# EAGLE design spi mit sram v1 (EAGLE 9.5.2)
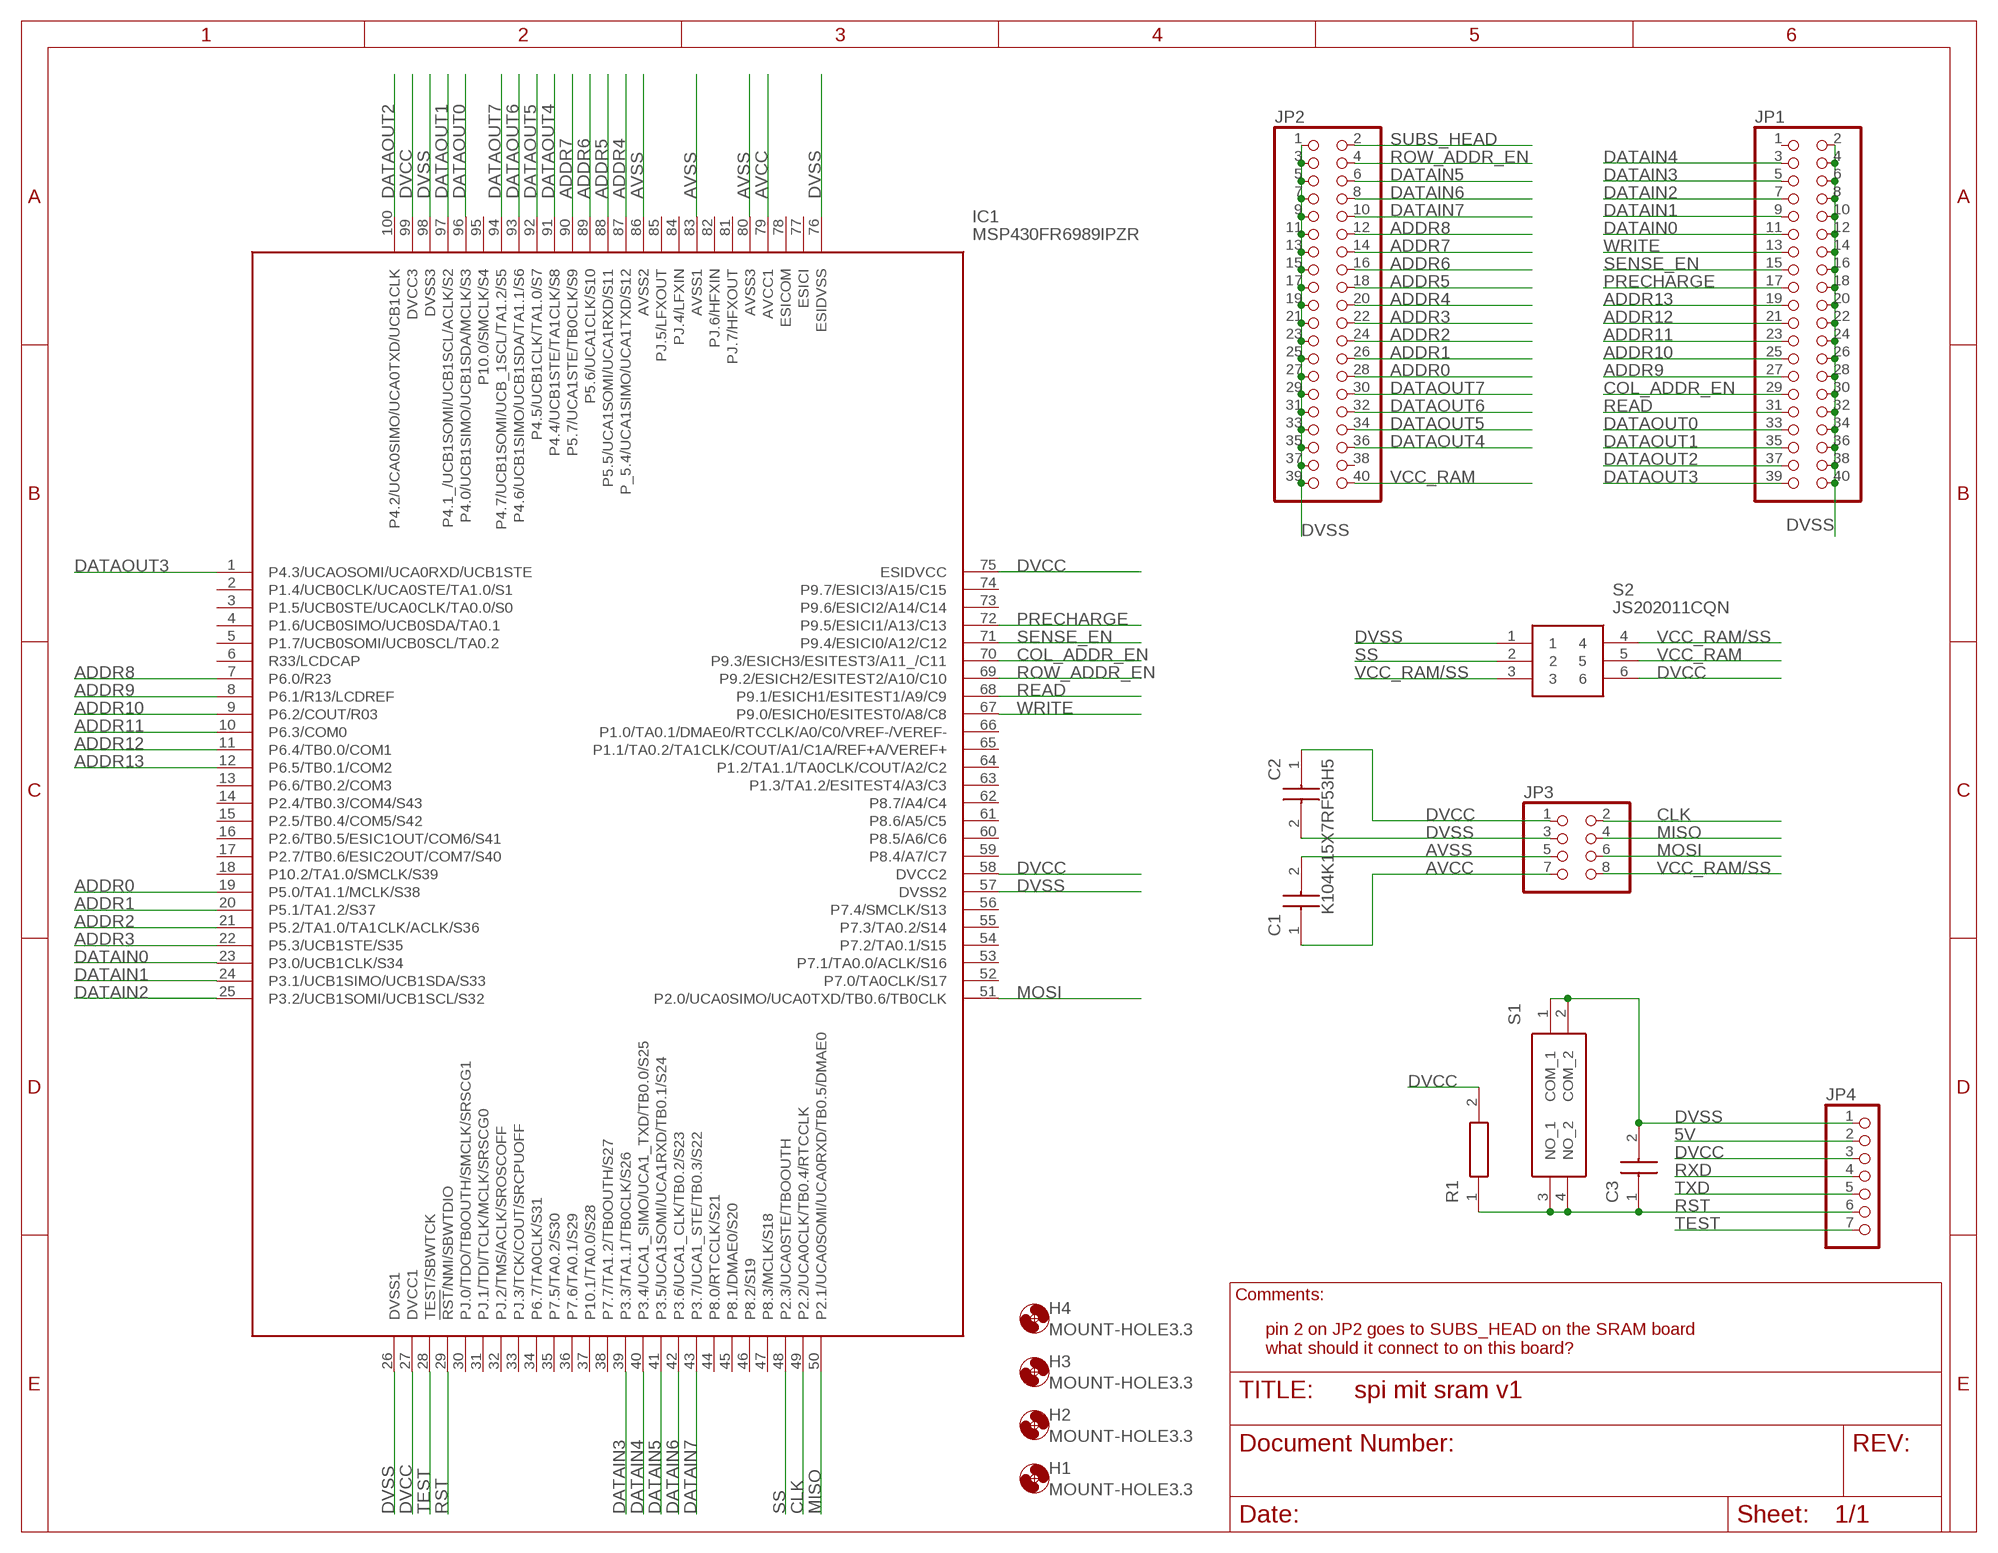
[diagram p0: schematic, sheet 1]

## Parts
C1  K104K15X7RF53H5  [K104K15X7RF53H5]
C2  K104K15X7RF53H5  [K104K15X7RF53H5]
C3  K104K15X7RF53H5  [K104K15X7RF53H5]
H1  MOUNT-HOLE3.3  [3,3]
H2  MOUNT-HOLE3.3  [3,3]
H3  MOUNT-HOLE3.3  [3,3]
H4  MOUNT-HOLE3.3  [3,3]
IC1  MSP430FR6989IPZR  [QFP50P1600X1600X160-100N]
JP1  PINHD-2X20  [2X20]
JP2  PINHD-2X20  [2X20]
JP3  PINHD-2X4  [2X04]
JP4  PINHD-1X7  [1X07]
R1  MF0207FTE52-10K  [RESAD1590W60L630D240]
S1  1825910-3  [18259103]
S2  JS202011CQN  [JS202011CQN]

## Nets
5V: JP4.2
ADDR0: IC1.19(P5.0/TA1.1/MCLK/S38) JP2.28
ADDR1: IC1.20(P5.1/TA1.2/S37) JP2.26
ADDR2: IC1.21(P5.2/TA1.0/TA1CLK/ACLK/S36) JP2.24
ADDR3: IC1.22(P5.3/UCB1STE/S35) JP2.22
ADDR4: IC1.87(P_5.4/UCA1SIMO/UCA1TXD/S12) JP2.20
ADDR5: IC1.88(P5.5/UCA1SOMI/UCA1RXD/S11) JP2.18
ADDR6: IC1.89(P5.6/UCA1CLK/S10) JP2.16
ADDR7: IC1.90(P5.7/UCA1STE/TB0CLK/S9) JP2.14
ADDR8: IC1.7(P6.0/R23) JP2.12
ADDR9: IC1.8(P6.1/R13/LCDREF) JP1.27
ADDR10: IC1.9(P6.2/COUT/R03) JP1.25
ADDR11: IC1.10(P6.3/COM0) JP1.23
ADDR12: IC1.11(P6.4/TB0.0/COM1) JP1.21
ADDR13: IC1.12(P6.5/TB0.1/COM2) JP1.19
AVCC: C1.1 IC1.79(AVCC1) JP3.7
AVSS: C1.2 IC1.80(AVSS3) IC1.83(AVSS1) IC1.86(AVSS2) JP3.5
CLK: IC1.49(P2.2/UCA0CLK/TB0.4/RTCCLK) JP3.2
COL_ADDR_EN: IC1.70(P9.3/ESICH3/ESITEST3/A11_/C11) JP1.29
DATAIN0: IC1.23(P3.0/UCB1CLK/S34) JP1.11
DATAIN1: IC1.24(P3.1/UCB1SIMO/UCB1SDA/S33) JP1.9
DATAIN2: IC1.25(P3.2/UCB1SOMI/UCB1SCL/S32) JP1.7
DATAIN3: IC1.39(P3.3/TA1.1/TB0CLK/S26) JP1.5
DATAIN4: IC1.40(P3.4/UCA1_SIMO/UCA1_TXD/TB0.0/S25) JP1.3
DATAIN5: IC1.41(P3.5/UCA1SOMI/UCA1RXD/TB0.1/S24) JP2.6
DATAIN6: IC1.42(P3.6/UCA1_CLK/TB0.2/S23) JP2.8
DATAIN7: IC1.43(P3.7/UCA1_STE/TB0.3/S22) JP2.10
DATAOUT0: IC1.96(P4.0/UCB1SIMO/UCB1SDA/MCLK/S3) JP1.33
DATAOUT1: IC1.97(P4.1_/UCB1SOMI/UCB1SCL/ACLK/S2) JP1.35
DATAOUT2: IC1.100(P4.2/UCA0SIMO/UCA0TXD/UCB1CLK) JP1.37
DATAOUT3: IC1.1(P4.3/UCAOSOMI/UCA0RXD/UCB1STE) JP1.39
DATAOUT4: IC1.91(P4.4/UCB1STE/TA1CLK/S8) JP2.36
DATAOUT5: IC1.92(P4.5/UCB1CLK/TA1.0/S7) JP2.34
DATAOUT6: IC1.93(P4.6/UCB1SIMO/UCB1SDA/TA1.1/S6) JP2.32
DATAOUT7: IC1.94(P4.7/UCB1SOMI/UCB_1SCL/TA1.2/S5) JP2.30
DVCC: C2.1 IC1.27(DVCC1) IC1.58(DVCC2) IC1.75(ESIDVCC) IC1.99(DVCC3) JP3.1 JP4.3 R1.2 S2.6
DVSS: C2.2 C3.2 IC1.26(DVSS1) IC1.57(DVSS2) IC1.76(ESIDVSS) IC1.98(DVSS3) JP1.2 JP1.4 JP1.6 JP1.8 JP1.10 JP1.12 JP1.14 JP1.16 JP1.18 JP1.20 JP1.22 JP1.24 JP1.26 JP1.28 JP1.30 JP1.32 JP1.34 JP1.36 JP1.38 JP1.40 JP2.1 JP2.3 JP2.5 JP2.7 JP2.9 JP2.11 JP2.13 JP2.15 JP2.17 JP2.19 JP2.21 JP2.23 JP2.25 JP2.27 JP2.29 JP2.31 JP2.33 JP2.35 JP2.37 JP2.39 JP3.3 JP4.1 S1.1(COM_1) S1.2(COM_2) S2.1
MISO: IC1.50(P2.1/UCA0SOMI/UCA0RXD/TB0.5/DMAE0) JP3.4
MOSI: IC1.51(P2.0/UCA0SIMO/UCA0TXD/TB0.6/TB0CLK) JP3.6
PRECHARGE: IC1.72(P9.5/ESICI1/A13/C13) JP1.17
READ: IC1.68(P9.1/ESICH1/ESITEST1/A9/C9) JP1.31
ROW_ADDR_EN: IC1.69(P9.2/ESICH2/ESITEST2/A10/C10) JP2.4
RST: C3.1 IC1.29(!RST!/NMI/SBWTDIO) JP4.6 R1.1 S1.3(NO_1) S1.4(NO_2)
RXD: JP4.4
SENSE_EN: IC1.71(P9.4/ESICI0/A12/C12) JP1.15
SS: IC1.48(P2.3/UCA0STE/TBOOUTH) S2.2
SUBS_HEAD: JP2.2
TEST: IC1.28(TEST/SBWTCK) JP4.7
TXD: JP4.5
VCC_RAM: JP2.40 S2.5
VCC_RAM/SS: JP3.8 S2.3 S2.4
WRITE: IC1.67(P9.0/ESICH0/ESITEST0/A8/C8) JP1.13
Unconnected: IC1.2(P1.4/UCB0CLK/UCA0STE/TA1.0/S1) IC1.3(P1.5/UCB0STE/UCA0CLK/TA0.0/S0) IC1.4(P1.6/UCB0SIMO/UCB0SDA/TA0.1) IC1.5(P1.7/UCB0SOMI/UCB0SCL/TA0.2) IC1.6(R33/LCDCAP) IC1.13(P6.6/TB0.2/COM3) IC1.14(P2.4/TB0.3/COM4/S43) IC1.15(P2.5/TB0.4/COM5/S42) IC1.16(P2.6/TB0.5/ESIC1OUT/COM6/S41) IC1.17(P2.7/TB0.6/ESIC2OUT/COM7/S40) IC1.18(P10.2/TA1.0/SMCLK/S39) IC1.30(PJ.0/TDO/TB0OUTH/SMCLK/SRSCG1) IC1.31(PJ.1/TDI/TCLK/MCLK/SRSCG0) IC1.32(PJ.2/TMS/ACLK/SROSCOFF) IC1.33(PJ.3/TCK/COUT/SRCPUOFF) IC1.34(P6.7/TA0CLK/S31) IC1.35(P7.5/TA0.2/S30) IC1.36(P7.6/TA0.1/S29) IC1.37(P10.1/TA0.0/S28) IC1.38(P7.7/TA1.2/TB0OUTH/S27) IC1.44(P8.0/RTCCLK/S21) IC1.45(P8.1/DMAE0/S20) IC1.46(P8.2/S19) IC1.47(P8.3/MCLK/S18) IC1.52(P7.0/TA0CLK/S17) IC1.53(P7.1/TA0.0/ACLK/S16) IC1.54(P7.2/TA0.1/S15) IC1.55(P7.3/TA0.2/S14) IC1.56(P7.4/SMCLK/S13) IC1.59(P8.4/A7/C7) IC1.60(P8.5/A6/C6) IC1.61(P8.6/A5/C5) IC1.62(P8.7/A4/C4) IC1.63(P1.3/TA1.2/ESITEST4/A3/C3) IC1.64(P1.2/TA1.1/TA0CLK/COUT/A2/C2) IC1.65(P1.1/TA0.2/TA1CLK/COUT/A1/C1A/REF+A/VEREF+) IC1.66(P1.0/TA0.1/DMAE0/RTCCLK/A0/C0/VREF-/VEREF-) IC1.73(P9.6/ESICI2/A14/C14) IC1.74(P9.7/ESICI3/A15/C15) IC1.77(ESICI) IC1.78(ESICOM) IC1.81(PJ.7/HFXOUT) IC1.82(PJ.6/HFXIN) IC1.84(PJ.4/LFXIN) IC1.85(PJ.5/LFXOUT) IC1.95(P10.0/SMCLK/S4) JP1.1 JP2.38

## Notes on the sheet
- Comments:
- pin 2 on JP2 goes to SUBS_HEAD on the SRAM board
  what should it connect to on this board?

## Library data of the parts
C1-C3 = K104K15X7RF53H5:K104K15X7RF53H5: Capacitor;Ceramic;Cap 0.1 uF Vishay K 100nF Ceramic Multilayer Capacitor, 50 V dc, +125C, X7R Dielectric, +/-10% Source: Datasheet <http://www.vishay.com/docs/45171/kseries.pdf>; ALLIED_NUMBER: 70123004; ALLIED_PRICE-STOCK: https://www.alliedelec.com/bc-components-vishay-k104k15x7rf53h5/70123004/; DESCRIPTION: Capacitor;Ceramic;Cap 0.1 uF Vishay K 100nF Ceramic Multilayer Capacitor, 50 V dc, +125C, X7R Dielectric, +/-10%; HEIGHT: mm; MANUFACTURER_NAME: Vishay; MANUFACTURER_PART_NUMBER: K104K15X7RF53H5; MOUSER_PART_NUMBER: 594-K104K15X7RF53H5; MOUSER_PRICE-STOCK: https://www.mouser.com/Search/Refine.aspx?Keyword=594-K104K15X7RF53H5; RS_PART_NUMBER: 8523270; RS_PRICE-STOCK: http://uk.rs-online.com/web/p/products/8523270
H1-H4 = holes:MOUNT-HOLE: MOUNTING HOLE with drill center marker
IC1 = MSP430FR6989IPZR:MSP430FR6989IPZR: MSP430FR6989 16 MHz ULP Microcontroller - 128 KB FRAM, 2KB SRAM, 83 IO, ADC12, LCD, AES, Scan IF Source: Datasheet <http://www.ti.com/lit/gpn/msp430fr6989>; DESCRIPTION: MSP430FR6989 16 MHz ULP Microcontroller - 128 KB FRAM, 2KB SRAM, 83 IO, ADC12, LCD, AES, Scan IF; HEIGHT: 1.6mm; MANUFACTURER_NAME: Texas Instruments; MANUFACTURER_PART_NUMBER: MSP430FR6989IPZR; MOUSER_PART_NUMBER: 595-MSP430FR6989IPZR; MOUSER_PRICE-STOCK: https://www.mouser.com/Search/Refine.aspx?Keyword=595-MSP430FR6989IPZR
JP1 JP2 = pinhead:PINHD-2X20: PIN HEADER
JP3 = pinhead:PINHD-2X4: PIN HEADER
JP4 = pinhead:PINHD-1X7: PIN HEADER
R1 = MF0207FTE52-10K:MF0207FTE52-10K: Metal Film Resistors - Through Hole 0.6W 1% 10K ohm 50ppm Source: Datasheet <http://www.mouser.com/ds/2/447/Yageo LR_MF0_2013-775182.pdf>; DESCRIPTION: Metal Film Resistors - Through Hole 0.6W 1% 10K ohm 50ppm; HEIGHT: mm; MANUFACTURER_NAME: YAGEO (PHYCOMP); MANUFACTURER_PART_NUMBER: MF0207FTE52-10K; MOUSER_PART_NUMBER: 603-MF0207FTE52-10K; MOUSER_PRICE-STOCK: https://www.mouser.com/Search/Refine.aspx?Keyword=603-MF0207FTE52-10K
S1 = 1825910-3:1825910-3: Switch Tactile OFF (ON) SPST Round Button PC Pins 0.05A 24VDC 100000Cycles 2.55N Thru-Hole Loose Source: Datasheet <http://uk.rs-online.com/web/p/products/4791407>; DESCRIPTION: Switch Tactile OFF (ON) SPST Round Button PC Pins 0.05A 24VDC 100000Cycles 2.55N Thru-Hole Loose; HEIGHT: 4.3mm; MANUFACTURER_NAME: TE Connectivity; MANUFACTURER_PART_NUMBER: 1825910-3; MOUSER_PART_NUMBER: N/A; MOUSER_PRICE-STOCK: https://www.mouser.com/Search/Refine.aspx?Keyword=N%2FA; RS_PART_NUMBER: 7455817P; RS_PRICE-STOCK: http://uk.rs-online.com/web/p/products/7455817P
S2 = JS202011CQN:JS202011CQN: Slide Switches DPDT THRU HOLE .3A Source: Datasheet <http://www.ckswitches.com/media/1422/js.pdf>; DESCRIPTION: Slide Switches DPDT THRU HOLE .3A; HEIGHT: mm; MANUFACTURER_NAME: C & K COMPONENTS; MANUFACTURER_PART_NUMBER: JS202011CQN; MOUSER_PART_NUMBER: 611-JS202011CQN; MOUSER_PRICE-STOCK: https://www.mouser.com/Search/Refine.aspx?Keyword=611-JS202011CQN; RS_PART_NUMBER: 1546136; RS_PRICE-STOCK: http://uk.rs-online.com/web/p/products/1546136

## Board
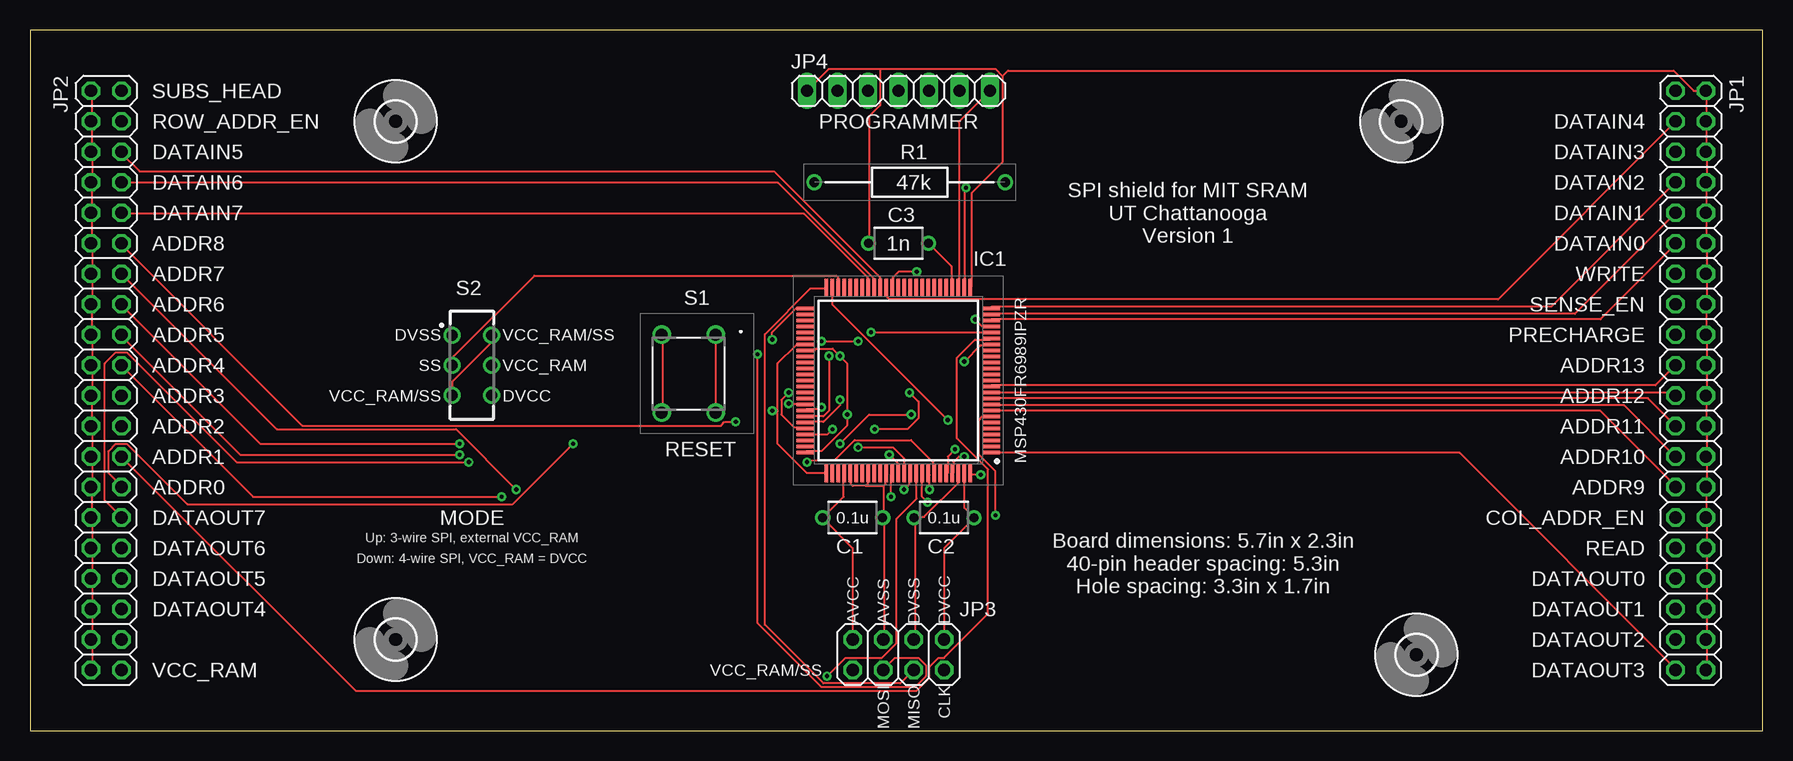
[diagram p1: board, top side]
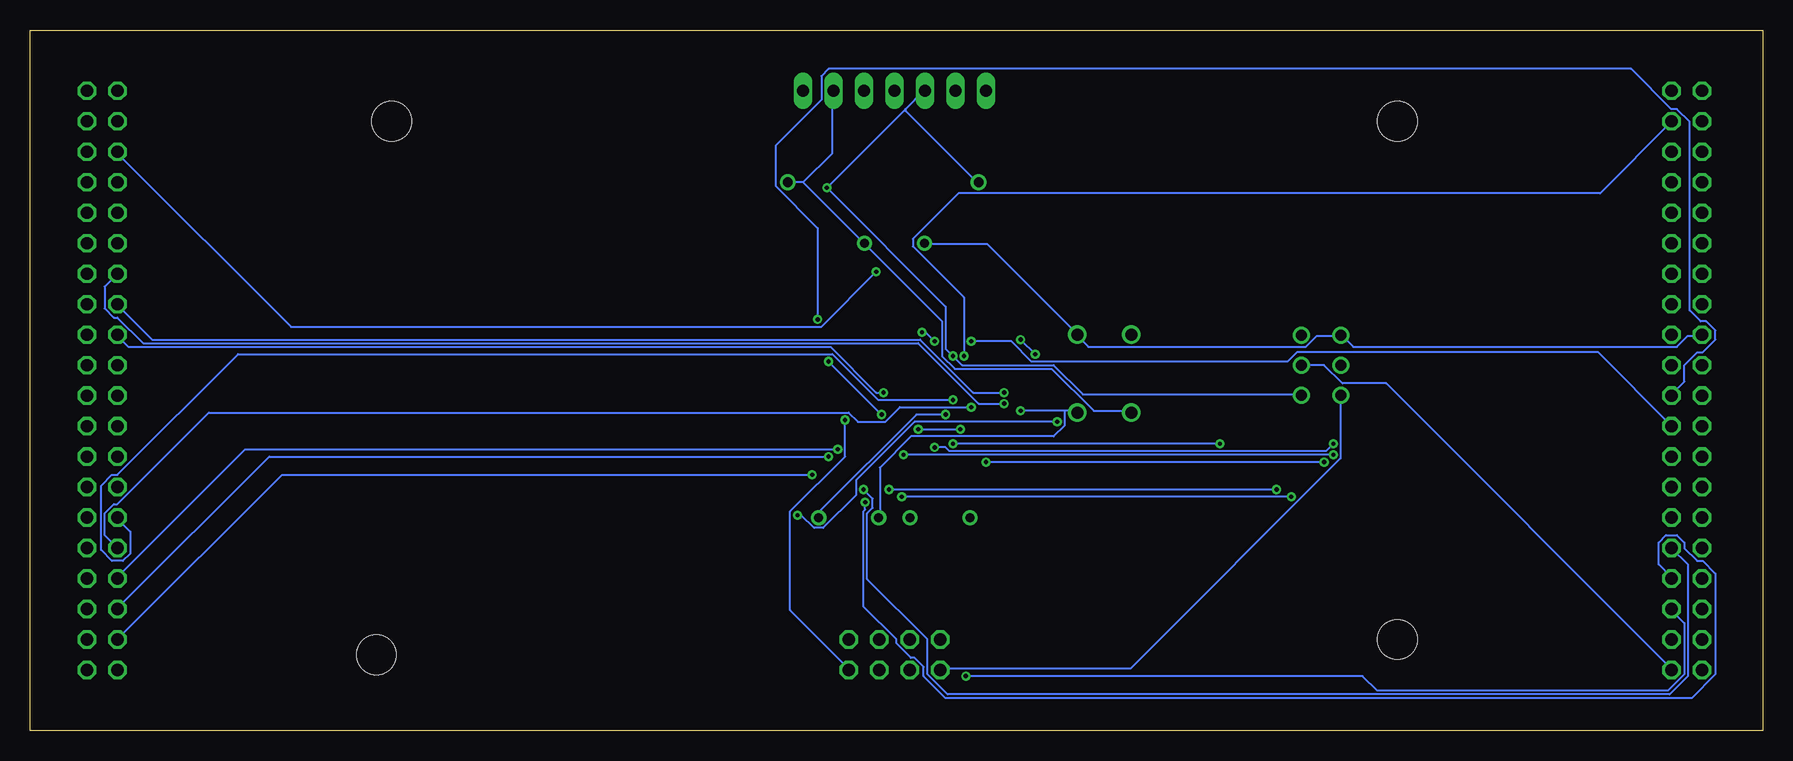
[diagram p2: board, bottom side, seen from below]

Size 144.45 x 58.41 mm. Coordinates in mm from the lower left corner, seen from the top.
Outline: 0,0 144.45,0 144.45,58.41 0,58.41 0,0
Copper layers (1*16): Top 0.035mm / dielectric 1.5mm / Bottom 0.035mm
Design rules "default": minimum track width 6mil, minimum drill 0.35mm, track to track 6mil, track to pad 6mil, pad to pad 6mil, via to via 6mil, smd to smd 6mil, copper to edge 40mil, drill to drill 6mil, minimum pad ring 10mil, minimum via ring 8mil, stop-mask expansion 4mil, vias tented up to drill 0mil, thermal gap 10mil

### Footprints (pad centres in the part's own frame; a part is rotated, then mirrored left to right if it is on the bottom)
K104K15X7RF53H5 = drill 0.75 pad 1.25: 1 -2.5,0; 2 2.5,0
3,3 = hole 3.3: 0,0
QFP50P1600X1600X160-100N = smd 1.475 x 0.3: 1 -7.738,6; 2 -7.738,5.5; 3 -7.738,5; 4 -7.738,4.5; 5 -7.738,4; 6 -7.738,3.5; 7 -7.738,3; 8 -7.738,2.5; 9 -7.738,2; 10 -7.738,1.5; 11 -7.738,1; 12 -7.738,0.5; 13 -7.738,0; 14 -7.738,-0.5; 15 -7.738,-1; 16 -7.738,-1.5; 17 -7.738,-2; 18 -7.738,-2.5; 19 -7.738,-3; 20 -7.738,-3.5; 21 -7.738,-4; 22 -7.738,-4.5; 23 -7.738,-5; 24 -7.738,-5.5; 25 -7.738,-6; 51 7.738,-6; 52 7.738,-5.5; 53 7.738,-5; 54 7.738,-4.5; 55 7.738,-4; 56 7.738,-3.5; 57 7.738,-3; 58 7.738,-2.5; 59 7.738,-2; 60 7.738,-1.5; 61 7.738,-1; 62 7.738,-0.5; 63 7.738,0; 64 7.738,0.5; 65 7.738,1; 66 7.738,1.5; 67 7.738,2; 68 7.738,2.5; 69 7.738,3; 70 7.738,3.5; 71 7.738,4; 72 7.738,4.5; 73 7.738,5; 74 7.738,5.5; 75 7.738,6 | smd 0.3 x 1.475: 26 -6,-7.738; 27 -5.5,-7.738; 28 -5,-7.738; 29 -4.5,-7.738; 30 -4,-7.738; 31 -3.5,-7.738; 32 -3,-7.738; 33 -2.5,-7.738; 34 -2,-7.738; 35 -1.5,-7.738; 36 -1,-7.738; 37 -0.5,-7.738; 38 0,-7.738; 39 0.5,-7.738; 40 1,-7.738; 41 1.5,-7.738; 42 2,-7.738; 43 2.5,-7.738; 44 3,-7.738; 45 3.5,-7.738; 46 4,-7.738; 47 4.5,-7.738; 48 5,-7.738; 49 5.5,-7.738; 50 6,-7.738; 76 6,7.738; 77 5.5,7.738; 78 5,7.738; 79 4.5,7.738; 80 4,7.738; 81 3.5,7.738; 82 3,7.738; 83 2.5,7.738; 84 2,7.738; 85 1.5,7.738; 86 1,7.738; 87 0.5,7.738; 88 0,7.738; 89 -0.5,7.738; 90 -1,7.738; 91 -1.5,7.738; 92 -2,7.738; 93 -2.5,7.738; 94 -3,7.738; 95 -3.5,7.738; 96 -4,7.738; 97 -4.5,7.738; 98 -5,7.738; 99 -5.5,7.738; 100 -6,7.738
2X20 = drill 1.016 octagon: 1 -24.13,-1.27; 2 -24.13,1.27; 3 -21.59,-1.27; 4 -21.59,1.27; 5 -19.05,-1.27; 6 -19.05,1.27; 7 -16.51,-1.27; 8 -16.51,1.27; 9 -13.97,-1.27; 10 -13.97,1.27; 11 -11.43,-1.27; 12 -11.43,1.27; 13 -8.89,-1.27; 14 -8.89,1.27; 15 -6.35,-1.27; 16 -6.35,1.27; 17 -3.81,-1.27; 18 -3.81,1.27; 19 -1.27,-1.27; 20 -1.27,1.27; 21 1.27,-1.27; 22 1.27,1.27; 23 3.81,-1.27; 24 3.81,1.27; 25 6.35,-1.27; 26 6.35,1.27; 27 8.89,-1.27; 28 8.89,1.27; 29 11.43,-1.27; 30 11.43,1.27; 31 13.97,-1.27; 32 13.97,1.27; 33 16.51,-1.27; 34 16.51,1.27; 35 19.05,-1.27; 36 19.05,1.27; 37 21.59,-1.27; 38 21.59,1.27; 39 24.13,-1.27; 40 24.13,1.27
2X04 = drill 1.016 octagon: 1 -3.81,-1.27; 2 -3.81,1.27; 3 -1.27,-1.27; 4 -1.27,1.27; 5 1.27,-1.27; 6 1.27,1.27; 7 3.81,-1.27; 8 3.81,1.27
1X07 = drill 1.016 long: 1 -7.62,0; 2 -5.08,0; 3 -2.54,0; 4 0,0; 5 2.54,0; 6 5.08,0; 7 7.62,0
RESAD1590W60L630D240 = drill 0.8 pad 1.2: 1 0,0; 2 15.9,0
18259103 = drill 0.99 pad 1.54: 1 0,0; 2 0,-6.5; 3 -4.5,0; 4 -4.5,-6.5
JS202011CQN = drill 0.9 pad 1.4: 1 -2.5,-1.65; 2 0,-1.65; 3 2.5,-1.65; 4 -2.5,1.65; 5 0,1.65; 6 2.5,1.65

### Placement (x,y rotation side)
C1  68.58,17.78 0 top
C2  76.2,17.78 180 top
C3  72.39,40.64 180 top
H1  30.48,50.8 0 top
H2  30.48,7.62 0 top
H3  115.57,6.35 0 top
H4  114.3,50.8 0 top
IC1  72.39,29.21 180 top
JP1  138.43,29.21 270 top
JP2  6.35,29.21 270 top
JP3  72.39,6.35 180 top
JP4  72.39,53.34 0 top
R1  81.28,45.72 180 top
S1  57.15,33.02 0 top
S2  36.83,30.48 270 top

### Tracks (layer width: path | path; a pad name or v marks a point on that pad's centre or on a via)
ADDR0  (via drill 0.35)
  Top 0.152: v77.88,30.79 79.25,32.16 80.01,32.16 IC1.19 | v73.46,26.36 69.95,26.36 v67.51,23.93 | v45.26,23.93 40.23,18.9 13.11,18.9 8.08,23.93 7.16,23.93 6.55,23.32 6.55,21.49 7.62,20.42 JP2.28
  Bottom 0.152: v73.46,26.36 v77.88,30.79 | v45.26,23.93 v67.51,23.93
ADDR1
  Top 0.152: JP2.26 27.13,3.35 73.91,3.35 74.98,4.42 74.98,5.33 75.74,6.1 76.2,6.1 79.86,9.75 79.86,21.79 77.27,24.38 77.27,31.09 78.79,32.61 80.01,32.61 IC1.20
ADDR2  (via drill 0.35)
  Top 0.152: v70.1,33.22 80.01,33.22 IC1.21 | v65.99,32.46 v69.04,32.46
  Bottom 0.152: v70.1,33.22 69.8,33.22 v69.04,32.46 | v65.99,32.46 62.64,32.46 60.96,30.79 39.62,30.79 38.86,31.55 13.72,31.55 7.62,25.45 JP2.24
ADDR3  (via drill 0.35)
  Top 0.152: v78.79,34.29 79.4,33.68 80.01,33.68 IC1.22
  Bottom 0.152: v78.79,34.29 78.79,41.91 82.3,45.41 82.3,48.77 78.49,52.58 78.49,54.56 77.88,55.17 10.97,55.17 7.62,51.82 7.16,51.82 6.1,50.75 6.1,35.05 5.18,34.14 4.72,34.14 3.96,33.38 3.96,32.61 5.03,31.55 5.49,31.55 6.55,30.48 6.55,29.11 7.62,28.04 JP2.22
ADDR4  (via drill 0.35)
  Top 0.152: v71.78,19.51 71.78,21.34 IC1.87 | v39.32,19.51 18.59,19.51 JP2.20
  Bottom 0.152: v39.32,19.51 v71.78,19.51
ADDR5  (via drill 0.35)
  Top 0.152: IC1.88 72.39,22.25 v71.63,23.01 | v35.81,23.01 17.53,23.01 7.62,32.92 JP2.18
  Bottom 0.152: v35.81,23.01 v71.63,23.01
ADDR6  (via drill 0.35)
  Top 0.152: v69.04,23.62 71.93,23.62 72.85,22.71 72.85,21.49 IC1.89 | v35.81,23.93 19.2,23.93 7.62,35.51 JP2.16
  Bottom 0.152: v69.04,23.62 68.12,23.62 67.82,23.32 36.42,23.32 v35.81,23.93
ADDR7  (via drill 0.35)
  Top 0.152: v72.85,20.12 73.3,20.57 73.3,21.34 IC1.90 | v40.54,20.12 35.51,25.15 20.57,25.15 JP2.14
  Bottom 0.152: v40.54,20.12 v72.85,20.12
ADDR8  (via drill 0.35)
  Top 0.152: v80.47,17.98 80.47,21.64 79.1,23.01 79.1,25.91 79.4,26.21 80.01,26.21 IC1.7 | v58.83,25.76 57.91,25.76 57.61,25.45 22.71,25.45 7.62,40.54 JP2.12
  Bottom 0.152: v80.47,17.98 80.16,17.98 79.1,16.92 78.33,16.92 75.59,19.66 75.59,20.88 70.71,25.76 v58.83,25.76
ADDR9
  Top 0.152: IC1.8 80.16,26.67 130.91,26.67 137.16,20.42 JP1.27
ADDR10
  Top 0.152: JP1.25 132.89,27.13 80.16,27.13 IC1.9
ADDR11
  Top 0.152: IC1.10 80.16,27.74 134.87,27.74 137.16,25.45 JP1.23
ADDR12
  Top 0.152: IC1.11 80.16,28.19 137.01,28.19 137.16,28.04 JP1.21
ADDR13
  Top 0.152: JP1.19 135.48,28.8 80.16,28.8 IC1.12
AVCC
  Top 0.152: IC1.79 67.82,21.34 67.82,19.51 66.14,17.83 C1.1 66.14,17.68 68.58,15.24 JP3.7
AVSS
  Top 0.152: 69.65,20.42 68.58,20.42 68.43,20.57 68.43,21.34 IC1.80 | 69.65,20.42 69.8,20.57 69.8,21.34 IC1.83 | 71.17,20.42 71.32,20.57 71.32,21.34 IC1.86 | 69.65,20.42 71.17,20.42 | 71.17,20.42 71.17,17.83 C1.2 71.17,17.68 71.17,7.62 JP3.5
CLK  (via drill 0.35)
  Top 0.152: v76.5,25.91 66.9,35.51 66.9,36.88 IC1.49
  Bottom 0.152: v76.5,25.91 76.5,22.86 81.08,18.29 81.08,10.06 76.2,5.18 JP3.2
COL_ADDR_EN  (via drill 0.35)
  Top 0.152: v67.51,27.58 67.51,27.13 66.14,25.76 64.77,25.76 IC1.70
  Bottom 0.152: v67.51,27.58 73.76,27.58 77.57,31.39 127.1,31.39 137.16,21.34 137.62,21.34 138.53,20.42 138.53,15.09 137.62,14.17 136.7,14.17 136.09,14.78 136.09,16.61 137.16,17.68 JP1.29
DATAIN0
  Top 0.152: IC1.23 80.16,34.29 130.91,34.29 137.16,40.54 JP1.11
DATAIN1
  Top 0.152: IC1.24 80.16,34.75 128.78,34.75 137.16,43.13 JP1.9
DATAIN2
  Top 0.152: JP1.7 126.8,35.36 80.16,35.36 IC1.25
DATAIN3  (via drill 0.35)
  Top 0.152: v73.91,38.25 72.39,38.25 71.93,37.8 71.93,37.03 IC1.39
  Bottom 0.152: v73.91,38.25 78.49,33.68 122.68,33.68 137.16,48.16 JP1.5
DATAIN4
  Top 0.152: IC1.40 71.48,36.88 71.48,36.12 71.63,35.97 122.38,35.97 137.16,50.75 JP1.3
DATAIN5
  Top 0.152: IC1.41 70.87,37.03 70.87,37.8 62.03,46.63 9.14,46.63 7.62,48.16 JP2.6
DATAIN6
  Top 0.152: JP2.8 62.33,45.72 70.41,37.64 70.41,37.03 IC1.42
DATAIN7
  Top 0.152: IC1.43 69.8,37.03 69.8,37.8 64.47,43.13 7.62,43.13 JP2.10
DATAOUT0  (via drill 0.35)
  Top 0.152: v77.11,23.47 76.5,22.86 76.5,21.49 IC1.96
  Bottom 0.152: v77.11,23.47 126.49,23.47 137.16,12.8 JP1.33
DATAOUT1  (via drill 0.35)
  Top 0.152: v77.88,22.86 77.42,22.86 76.96,22.4 76.96,21.49 IC1.97
  Bottom 0.152: v77.88,22.86 124.51,22.86 137.16,10.21 JP1.35
DATAOUT2  (via drill 0.35)
  Top 0.152: v79.25,21.34 78.49,21.34 IC1.100
  Bottom 0.152: v79.25,21.34 123.44,21.34 JP1.37
DATAOUT3
  Top 0.152: IC1.1 80.16,23.16 119.18,23.16 137.16,5.18 JP1.39
DATAOUT4  (via drill 0.35)
  Top 0.152: v66.45,4.57 67.97,6.1 71.02,6.1 72.24,7.32 72.24,17.68 73.91,19.36 73.91,21.34 IC1.91
  Bottom 0.152: v66.45,4.57 33.38,4.57 32.16,3.35 7.92,3.35 6.55,4.72 6.55,8.99 7.62,10.06 JP2.36
DATAOUT5  (via drill 0.35)
  Top 0.152: v74.83,19.05 74.37,19.51 74.37,21.34 IC1.92
  Bottom 0.152: v74.83,19.05 74.83,18.44 74.98,18.29 74.98,10.36 72.24,7.62 72.24,7.32 71.02,6.1 70.71,6.1 69.95,5.33 69.95,4.57 68.12,2.74 5.94,2.74 3.96,4.72 3.96,13.11 5.03,14.17 5.49,14.17 6.55,15.24 6.55,15.7 7.16,16.31 8.08,16.31 8.69,15.7 8.69,13.87 7.62,12.8 JP2.34
DATAOUT6  (via drill 0.35)
  Top 0.152: v74.98,20.12 74.98,21.34 IC1.93
  Bottom 0.152: v74.98,20.12 74.22,19.36 74.22,18.59 74.68,18.14 74.68,12.65 69.65,7.62 69.65,4.72 67.97,3.05 7.77,3.05 6.25,4.57 6.25,13.87 JP2.32
DATAOUT7  (via drill 0.35)
  Top 0.152: v64.77,22.4 64.92,22.55 67.06,22.55 68.73,24.23 73.46,24.23 75.29,22.4 75.29,21.49 IC1.94 | v36.58,22.4 17.22,22.4 8.08,31.55 7.16,31.55 6.25,30.63 6.25,19.2 7.62,17.83 JP2.30
  Bottom 0.152: v36.58,22.4 v64.77,22.4
DVCC  (via drill 0.35)
  Top 0.152: IC1.99 77.88,21.34 77.88,18.59 78.64,17.83 C2.1 78.64,17.68 76.2,15.24 JP3.1 | IC1.75 64.77,23.32 65.99,23.32 68.12,25.45 v68.12,26.36 68.12,30.63 v67.51,31.24 66.9,31.85 65.53,31.85 65.38,31.7 64.77,31.7 IC1.58 | v78.03,45.26 77.88,45.11 77.88,37.03 IC1.27
  Bottom 0.152: 71.48,51.82 69.95,53.34 JP4.3 | 71.48,51.82 v78.03,45.26 68.12,35.36 68.12,31.85 v67.51,31.24 66.75,30.48 59.13,30.48 56.69,28.04 38.56,28.04 S2.6 | 71.48,51.82 71.48,51.66 65.53,45.72 R1.2 | v68.12,26.36 70.56,26.36 78.64,18.29 78.64,17.83 C2.1
DVSS  (via drill 0.35)
  Top 0.152: 139.75,7.62 139.75,5.18 JP1.40 | 139.75,7.62 139.75,10.06 JP1.36 139.75,10.21 139.75,12.65 JP1.34 139.75,12.8 139.75,15.24 | 139.75,7.62 JP1.38 | 139.75,15.24 139.75,17.68 JP1.30 139.75,17.83 139.75,20.27 JP1.28 139.75,20.42 139.75,22.86 | 139.75,22.86 139.75,25.3 JP1.24 139.75,25.45 139.75,27.89 JP1.22 139.75,28.04 139.75,30.48 | 139.75,22.86 JP1.26 | 139.75,15.24 JP1.32 | 139.75,45.72 139.75,48.16 JP1.6 139.75,48.31 139.75,50.75 JP1.4 139.75,50.9 139.75,53.34 JP1.2 138.68,53.34 137.01,55.02 81.53,55.02 81.08,54.56 | 139.75,30.48 139.75,32.92 JP1.18 139.75,33.07 139.75,35.51 JP1.16 139.75,35.66 139.75,38.1 | 139.75,38.1 139.75,40.54 JP1.12 139.75,40.69 139.75,43.13 JP1.10 139.75,43.28 139.75,45.72 | 139.75,38.1 JP1.14 | 139.75,45.72 JP1.8 | 139.75,30.48 JP1.20 | 5.18,7.62 5.18,5.18 JP2.39 | 5.18,7.62 5.18,10.06 JP2.35 5.18,10.21 5.18,12.65 JP2.33 5.18,12.8 5.18,15.24 | 5.18,7.62 JP2.37 | 5.18,15.24 5.18,17.68 JP2.29 5.18,17.83 5.18,20.27 JP2.27 5.18,20.42 5.18,22.86 | 5.18,22.86 5.18,25.3 JP2.23 5.18,25.45 5.18,27.89 JP2.21 5.18,28.04 5.18,30.48 | 5.18,22.86 JP2.25 | 5.18,15.24 JP2.31 | 5.18,45.72 5.18,48.16 JP2.5 5.18,48.31 5.18,50.75 JP2.3 5.18,50.9 5.18,53.34 JP2.1 | 5.18,30.48 5.18,32.92 JP2.17 5.18,33.07 5.18,35.51 JP2.15 5.18,35.66 5.18,38.1 | 5.18,38.1 5.18,40.54 JP2.11 5.18,40.69 5.18,43.13 JP2.9 5.18,43.28 5.18,45.72 | 5.18,38.1 JP2.13 | 5.18,45.72 JP2.7 | 5.18,30.48 JP2.19 | 81.08,54.56 81.08,47.4 78.49,44.81 78.49,37.03 IC1.26 | 81.08,54.56 80.47,55.17 70.87,55.17 | 70.87,55.17 66.6,55.17 JP4.1 | 70.87,55.17 70.87,52.12 69.95,51.21 69.95,40.69 C3.2 | IC1.98 77.42,21.34 77.42,20.73 74.52,17.83 73.76,17.83 C2.2 73.76,17.68 73.76,7.62 JP3.3
  Top 0.152: 62.33,26.67 62.33,23.93 64.77,21.49 66.29,21.49 IC1.76 | 62.33,26.67 62.33,30.63 63.86,32.16 64.62,32.16 IC1.57 | S1.1 S1.2 | v61.87,26.67 62.33,26.67
  Bottom 0.152: 58.22,26.67 57.15,26.67 S1.2 | 58.22,26.67 v61.87,26.67 | 58.22,26.67 58.22,25.45 59.13,24.54 71.02,24.54 73.61,21.95 73.61,17.83 C2.2 | C3.2 69.8,40.54 64.62,40.54 57.15,33.07 S1.1 57.15,32.92 56.24,32 38.1,32 37.19,32.92 35.2,32.92 S2.1 35.05,32.92 34.14,32 7.16,32 6.25,32.92 5.18,32.92 JP2.17
MISO
  Top 0.152: JP3.4 72.54,3.96 66.14,3.96 61.27,8.84 61.27,33.07 65.08,36.88 66.29,36.88 IC1.50
MOSI  (via drill 0.35)
  Top 0.152: v61.87,32.61 61.87,33.22 63.86,35.2 64.62,35.2 IC1.51 | v60.66,31.39 60.66,8.99 65.99,3.66 73.76,3.66 74.68,4.57 74.68,5.49 74.07,6.1 72.08,6.1 71.17,5.18 JP3.6
  Bottom 0.152: v60.66,31.39 v61.87,32.61
PRECHARGE  (via drill 0.35)
  Top 0.152: v66.9,25.15 66.45,24.69 64.77,24.69 IC1.72 | v70.41,25.15 73.15,25.15 74.07,26.06 74.07,27.43 v73.3,28.19
  Bottom 0.152: v70.41,25.15 v66.9,25.15 | v73.3,28.19 73.91,28.19 77.72,32 136.25,32 137.16,32.92 JP1.17
READ  (via drill 0.35)
  Top 0.152: v65.99,26.98 65.84,26.82 64.77,26.82 IC1.68
  Bottom 0.152: v65.99,26.98 71.93,26.98 73.15,25.76 75.44,25.76 76.2,26.52 129.54,26.52 137.16,18.9 137.47,18.9 138.23,18.14 138.23,16.31 JP1.31
ROW_ADDR_EN  (via drill 0.35)
  Top 0.152: v66.6,31.24 66.6,26.67 66.14,26.21 64.77,26.21 IC1.69
  Bottom 0.152: v66.6,31.24 66.6,36.12 70.87,40.39 70.87,41 67.06,44.81 13.56,44.81 7.62,50.75 JP2.4
RST
  Top 0.152: S1.4 52.73,26.67 52.73,32.92 S1.3 | IC1.29 76.81,37.03 76.81,38.71 74.98,40.54 C3.1
  Bottom 0.152: 80.01,45.72 R1.1 | 80.01,45.72 74.98,40.69 C3.1 74.83,40.54 68.43,34.14 68.43,31.24 67.36,30.18 59.28,30.18 55.78,26.67 52.73,26.67 S1.4 | 80.01,45.72 77.57,48.16 77.57,53.34 JP4.6
SENSE_EN  (via drill 0.35)
  Top 0.152: v63.25,28.19 62.64,27.58 62.64,26.36 63.7,25.3 64.62,25.3 IC1.71
  Bottom 0.152: v63.25,28.19 65.84,28.19 70.26,32.61 134.26,32.61 137.16,35.51 JP1.15
SS
  Top 0.152: IC1.48 67.36,37.03 67.36,37.8 67.21,37.95 42.06,37.95 35.2,31.09 35.2,30.48 S2.2
TEST
  Top 0.152: JP4.7 77.42,50.75 77.42,37.03 IC1.28
VCC_RAM
  Bottom 0.152: S2.5 36.58,30.48 35.05,28.96 31.39,28.96 7.62,5.18 JP2.40
VCC_RAM/SS
  Top 0.152: S2.3 35.2,28.04 35.2,29.11 38.41,32.31 38.41,32.92 S2.4
  Bottom 0.152: JP3.8 68.58,5.18 52.73,5.18 35.2,22.71 35.2,27.89 S2.3
WRITE  (via drill 0.35)
  Top 0.152: v63.25,27.28 64.62,27.28 IC1.67
  Bottom 0.152: v63.25,27.28 65.38,27.28 70.41,32.31 135.03,32.31 137.16,34.44 137.47,34.44 138.23,35.2 138.23,37.03 JP1.13

### Text on the board
tNames: SUBS_HEAD | ROW_ADDR_EN | PROGRAMMER | DATAIN4 | DATAIN5 | DATAIN3 | DATAIN6 | 47k | DATAIN2 | DATAIN7 | SPI shield for MIT SRAM / UT Chattanooga / Version 1 | DATAIN1 | ADDR8 | 1n | DATAIN0 | ADDR7 | WRITE | ADDR6 | SENSE_EN | ADDR5 | DVSS | VCC_RAM/SS | PRECHARGE | ADDR4 | SS | VCC_RAM | ADDR13 | MSP430FR6989IPZR | ADDR3 | VCC_RAM/SS | DVCC | ADDR12 | ADDR2 | ADDR11 | ADDR1 | RESET | ADDR10 | ADDR0 | ADDR9 | DATAOUT7 | MODE | 0.1u | 0.1u | COL_ADDR_EN | Up: 3-wire SPI, external VCC_RAM | DATAOUT6 | READ | Down: 4-wire SPI, VCC_RAM = DVCC | Board dimensions: 5.7in x 2.3in / 40-pin header spacing: 5.3in / Hole spacing: 3.3in x 1.7in | DATAOUT5 | DATAOUT0 | DATAOUT4 | DATAOUT1 | AVCC | AVSS | DVSS | DVCC | DATAOUT2 | VCC_RAM | VCC_RAM/SS | DATAOUT3 | MOSI | MISO | CLK
tDocu: R1